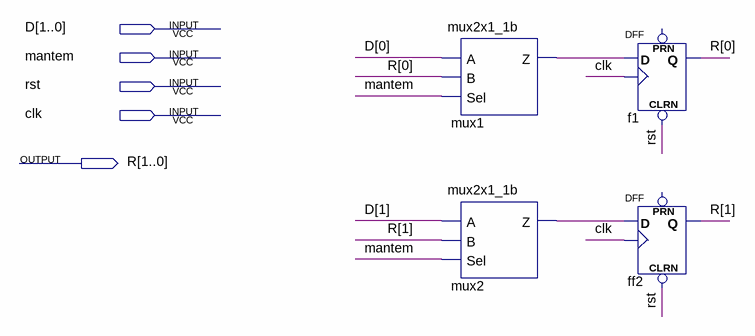
[diagram p0: schematic sheet]
// Quartus schematic Reg2b.bdf as structural Verilog: 4 symbols, 5 pins
module Reg2b (
  input  [1:0] D,
  input  mantem,
  input  rst,
  input  clk,
  output [1:0] R
);

  wire mux1_z, mux2_z;

  mux2x1_1b mux1 (.A(D[0]), .B(R[0]), .Sel(mantem), .Z(mux1_z));
  mux2x1_1b mux2 (.A(D[1]), .B(R[1]), .Sel(mantem), .Z(mux2_z));
  DFF f1 (.CLRN(rst), .CLK(clk), .D(mux1_z), .Q(R[0]));  // open: PRN
  DFF ff2 (.CLRN(rst), .CLK(clk), .D(mux2_z), .Q(R[1]));  // open: PRN
endmodule
